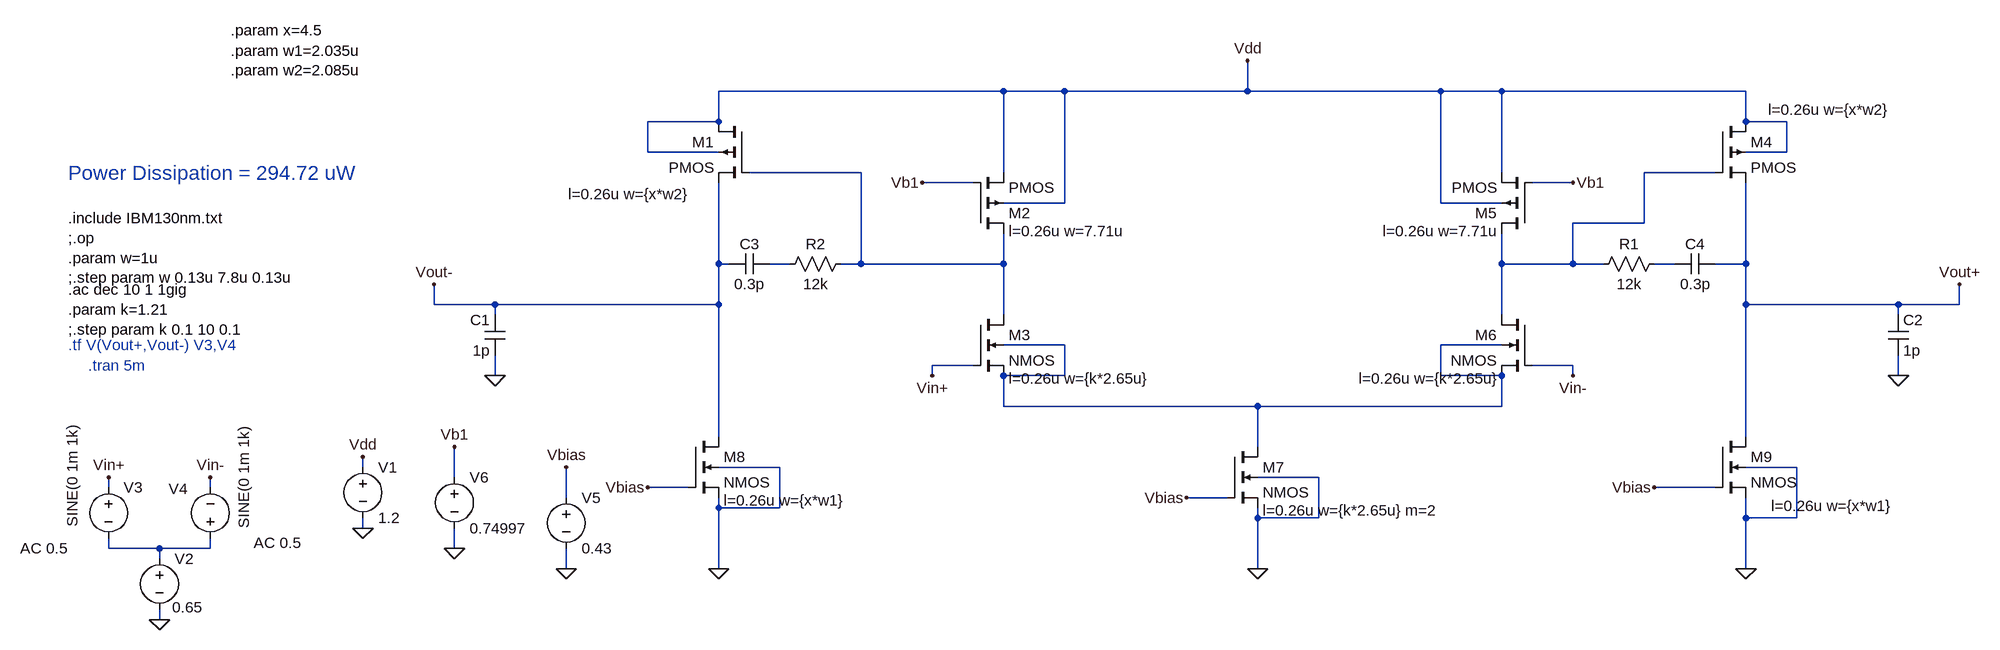
[diagram p0: schematic Two Stage Fully Differential Amplifier.asc]
Two Stage Fully Differential Amplifier.asc, the LTspice schematic file:
Version 4
SHEET 1 3456 864
WIRE 1920 -176 1472 -176
WIRE 2016 -176 1920 -176
WIRE 2304 -176 2304 -224
WIRE 2304 -176 2016 -176
WIRE 2608 -176 2304 -176
WIRE 2704 -176 2608 -176
WIRE 3088 -176 2704 -176
WIRE 1472 -128 1472 -176
WIRE 1472 -128 1360 -128
WIRE 3088 -128 3088 -176
WIRE 3152 -128 3088 -128
WIRE 1360 -80 1360 -128
WIRE 1472 -80 1360 -80
WIRE 3152 -80 3152 -128
WIRE 3152 -80 3088 -80
WIRE 1696 -48 1520 -48
WIRE 1920 -48 1920 -176
WIRE 2704 -48 2704 -176
WIRE 3040 -48 2928 -48
WIRE 1872 -32 1792 -32
WIRE 2816 -32 2752 -32
WIRE 2016 0 2016 -176
WIRE 2016 0 1920 0
WIRE 2608 0 2608 -176
WIRE 2704 0 2608 0
WIRE 2928 32 2928 -48
WIRE 2928 32 2816 32
WIRE 1472 96 1472 -32
WIRE 1488 96 1472 96
WIRE 1584 96 1552 96
WIRE 1696 96 1696 -48
WIRE 1696 96 1664 96
WIRE 1920 96 1920 48
WIRE 1920 96 1696 96
WIRE 2704 96 2704 48
WIRE 2816 96 2816 32
WIRE 2816 96 2704 96
WIRE 2864 96 2816 96
WIRE 2976 96 2944 96
WIRE 3088 96 3088 -32
WIRE 3088 96 3040 96
WIRE 1024 160 1024 128
WIRE 1120 160 1024 160
WIRE 1472 160 1472 96
WIRE 1472 160 1120 160
WIRE 3088 160 3088 96
WIRE 3328 160 3088 160
WIRE 3424 160 3424 128
WIRE 3424 160 3328 160
WIRE 1120 176 1120 160
WIRE 1920 176 1920 96
WIRE 2704 176 2704 96
WIRE 3328 176 3328 160
WIRE 2016 224 1920 224
WIRE 2704 224 2608 224
WIRE 1872 256 1808 256
WIRE 2816 256 2752 256
WIRE 1120 272 1120 240
WIRE 1808 272 1808 256
WIRE 2016 272 2016 224
WIRE 2016 272 1920 272
WIRE 2608 272 2608 224
WIRE 2704 272 2608 272
WIRE 2816 272 2816 256
WIRE 3328 272 3328 240
WIRE 1920 320 1920 272
WIRE 2320 320 1920 320
WIRE 2704 320 2704 272
WIRE 2704 320 2320 320
WIRE 1472 368 1472 160
WIRE 3088 368 3088 160
WIRE 2320 384 2320 320
WIRE 912 416 912 400
WIRE 1568 416 1472 416
WIRE 3168 416 3088 416
WIRE 1056 432 1056 384
WIRE 2416 432 2320 432
WIRE 512 448 512 432
WIRE 672 448 672 432
WIRE 1424 448 1360 448
WIRE 3040 448 2944 448
WIRE 1232 464 1232 416
WIRE 2272 464 2208 464
WIRE 1472 480 1472 464
WIRE 1568 480 1568 416
WIRE 1568 480 1472 480
WIRE 2320 496 2320 480
WIRE 2416 496 2416 432
WIRE 2416 496 2320 496
WIRE 3088 496 3088 464
WIRE 3168 496 3168 416
WIRE 3168 496 3088 496
WIRE 912 512 912 496
WIRE 512 544 512 528
WIRE 592 544 512 544
WIRE 672 544 672 528
WIRE 672 544 592 544
WIRE 1056 544 1056 512
WIRE 592 560 592 544
WIRE 1232 576 1232 544
WIRE 1472 576 1472 480
WIRE 2320 576 2320 496
WIRE 3088 576 3088 496
WIRE 592 656 592 640
FLAG 912 512 0
FLAG 912 400 Vdd
FLAG 592 656 0
FLAG 1808 272 Vin+
FLAG 1120 272 0
FLAG 1024 128 Vout-
FLAG 512 432 Vin+
FLAG 672 432 Vin-
FLAG 2816 272 Vin-
FLAG 3328 272 0
FLAG 3424 128 Vout+
FLAG 1232 576 0
FLAG 1232 416 Vbias
FLAG 2320 576 0
FLAG 2208 464 Vbias
FLAG 1056 544 0
FLAG 1056 384 Vb1
FLAG 2816 -32 Vb1
FLAG 2304 -224 Vdd
FLAG 1472 576 0
FLAG 3088 576 0
FLAG 1360 448 Vbias
FLAG 2944 448 Vbias
FLAG 1792 -32 Vb1
DATAFLAG 1248 160 ""
DATAFLAG 3216 160 ""
SYMBOL voltage 912 400 R0
WINDOW 123 0 0 Left 0
WINDOW 39 0 0 Left 0
SYMATTR InstName V1
SYMATTR Value 1.2
SYMBOL pmos4 1872 48 M180
WINDOW 123 56 4 Left 2
SYMATTR Value2 l=0.26u w=7.71u
SYMATTR InstName M2
SYMBOL nmos4 1872 176 R0
WINDOW 123 56 100 Left 2
SYMATTR Value2 l=0.26u w={k*2.65u}
SYMATTR InstName M3
SYMBOL voltage 592 544 R0
WINDOW 3 67 93 Right 2
WINDOW 123 -51 146 Left 2
WINDOW 39 0 0 Left 0
SYMATTR Value 0.65
SYMATTR InstName V2
SYMBOL cap 1136 176 M0
SYMATTR InstName C1
SYMATTR Value 1p
SYMBOL voltage 512 432 R0
WINDOW 3 -57 -80 VRight 2
WINDOW 123 -139 112 Left 2
WINDOW 39 0 0 Left 0
SYMATTR Value SINE(0 1m 1k)
SYMATTR Value2 AC 0.5
SYMATTR InstName V3
SYMBOL voltage 672 544 R180
WINDOW 3 -53 190 VLeft 2
WINDOW 123 -142 9 Left 2
WINDOW 39 0 0 Left 0
WINDOW 0 36 94 Left 2
SYMATTR Value SINE(0 1m 1k)
SYMATTR Value2 AC 0.5
SYMATTR InstName V4
SYMBOL pmos4 2752 48 R180
WINDOW 123 56 4 Left 2
SYMATTR Value2 l=0.26u w=7.71u
SYMATTR InstName M5
SYMBOL nmos4 2752 176 M0
WINDOW 123 56 100 Left 2
SYMATTR Value2 l=0.26u w={k*2.65u}
SYMATTR InstName M6
SYMBOL cap 3312 176 R0
SYMATTR InstName C2
SYMATTR Value 1p
SYMBOL voltage 1232 448 R0
WINDOW 123 0 0 Left 0
WINDOW 39 0 0 Left 0
SYMATTR InstName V5
SYMATTR Value 0.43
SYMBOL nmos4 2272 384 R0
WINDOW 123 56 100 Left 2
SYMATTR Value2 l=0.26u w={k*2.65u} m=2
SYMATTR InstName M7
SYMBOL voltage 1056 416 R0
WINDOW 123 0 0 Left 0
WINDOW 39 0 0 Left 0
SYMATTR InstName V6
SYMATTR Value 0.74997
SYMBOL pmos4 1520 -128 M0
WINDOW 123 98 114 Left 2
SYMATTR Value2 l=0.26u w={x*w2}
SYMATTR InstName M1
SYMBOL pmos4 3040 -128 R0
WINDOW 123 83 -19 Left 2
SYMATTR Value2 l=0.26u w={x*w2}
SYMATTR InstName M4
SYMBOL nmos4 1424 368 R0
WINDOW 123 56 100 Left 2
SYMATTR Value2 l=0.26u w={x*w1}
SYMATTR InstName M8
SYMBOL nmos4 3040 368 R0
WINDOW 123 88 109 Left 2
SYMATTR Value2 l=0.26u w={x*w1}
SYMATTR InstName M9
SYMBOL cap 1552 80 R90
WINDOW 0 0 32 VBottom 2
WINDOW 3 32 32 VTop 2
SYMATTR InstName C3
SYMATTR Value 0.3p
SYMBOL cap 3040 80 R90
WINDOW 0 0 32 VBottom 2
WINDOW 3 32 32 VTop 2
SYMATTR InstName C4
SYMATTR Value 0.3p
SYMBOL res 2960 80 R90
WINDOW 0 0 56 VBottom 2
WINDOW 3 32 56 VTop 2
SYMATTR InstName R1
SYMATTR Value 12k
SYMBOL res 1680 80 R90
WINDOW 0 0 56 VBottom 2
WINDOW 3 32 56 VTop 2
SYMATTR InstName R2
SYMATTR Value 12k
TEXT 448 24 Left 2 !.include IBM130nm.txt\n;.op\n.param w=1u\n;.step param w 0.13u 7.8u 0.13u
TEXT 448 136 Left 2 !.ac dec 10 1 1gig
TEXT 448 168 Left 2 !.param k=1.21\n;.step param k 0.1 10 0.1
TEXT 448 224 Left 2 ;.tf V(Vout+,Vout-) V3,V4
TEXT 448 -48 Left 3 ;Power Dissipation = 294.72 uW
TEXT 480 256 Left 2 ;.tran 5m
TEXT 704 -240 Left 2 !.param w1=2.035u\n.param w2=2.085u
TEXT 704 -272 Left 2 !.param x=4.5

The netlist it stands for:
* Two Stage Fully Differential Amplifier.asc
V1 Vdd 0 1.2
M2 N001 Vb1 Vdd Vdd PMOS l=0.26u w=7.71u
M3 N001 Vin+ N005 N005 NMOS l=0.26u w={k*2.65u}
V2 N006 0 0.65
C1 Vout- 0 1p
V3 Vin+ N006 SINE(0 1m 1k) AC 0.5
V4 N006 Vin- SINE(0 1m 1k) AC 0.5
M5 N002 Vb1 Vdd Vdd PMOS l=0.26u w=7.71u
M6 N002 Vin- N005 N005 NMOS l=0.26u w={k*2.65u}
C2 Vout+ 0 1p
V5 Vbias 0 0.43
M7 N005 Vbias 0 0 NMOS l=0.26u w={k*2.65u} m=2
V6 Vb1 0 0.74997
M1 Vdd N001 Vout- Vdd PMOS l=0.26u w={x*w2}
M4 Vdd N002 Vout+ Vdd PMOS l=0.26u w={x*w2}
M8 Vout- Vbias 0 0 NMOS l=0.26u w={x*w1}
M9 Vout+ Vbias 0 0 NMOS l=0.26u w={x*w1}
C3 N003 Vout- 0.3p
C4 Vout+ N004 0.3p
R1 N004 N002 12k
R2 N001 N003 12k
.model NMOS NMOS
.model PMOS PMOS
.lib standard.mos
.include IBM130nm.txt
;.op
.param w=1u
;.step param w 0.13u 7.8u 0.13u
.ac dec 10 1 1gig
.param k=1.21
;.step param k 0.1 10 0.1
* .tf V(Vout+,Vout-) V3,V4
* Power Dissipation = 294.72 uW
* .tran 5m
.param w1=2.035u
.param w2=2.085u
.param x=4.5
.backanno
.end